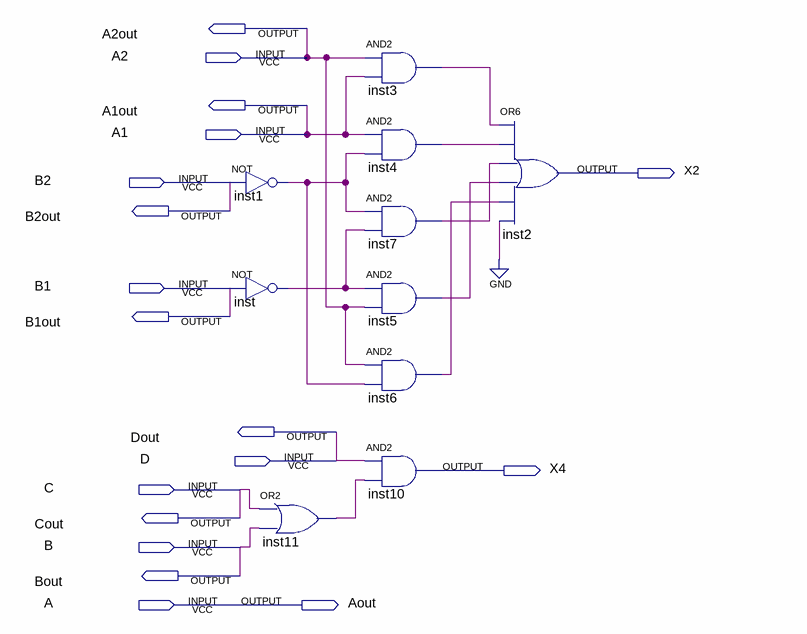
[diagram p0: schematic sheet]
// Quartus schematic Lab8.bdf as structural Verilog: 10 symbols, 18 pins
module Lab8 (
  input  A2,
  input  A1,
  input  B2,
  input  B1,
  input  D,
  input  C,
  input  B,
  input  A,
  output A2out,
  output A1out,
  output X2,
  output B2out,
  output B1out,
  output Dout,
  output X4,
  output Cout,
  output Bout,
  output Aout
);

  wire inst1_out, inst3_out, inst4_out, inst5_out, inst6_out, inst7_out, inst11_out, inst_out;

  not inst1 (inst1_out, B2);
  not inst (inst_out, B1);
  or inst11 (inst11_out, C, B);
  and inst3 (inst3_out, A2, A1);
  and inst4 (inst4_out, A1, inst1_out);
  and inst7 (inst7_out, inst1_out, inst_out);
  and inst5 (inst5_out, inst_out, A2);
  and inst6 (inst6_out, A2, inst1_out);
  and inst10 (X4, D, inst11_out);
  or inst2 (X2, inst3_out, inst4_out, inst7_out, inst5_out, inst6_out, 1'b0);

  assign A1out = A1;
  assign A2out = A2;
  assign Aout = A;
  assign B1out = B1;
  assign B2out = B2;
  assign Bout = B;
  assign Cout = C;
  assign Dout = D;
endmodule
